# EAGLE design SparkFun_EL_Escudo_Dos (EAGLE 7.2.0)
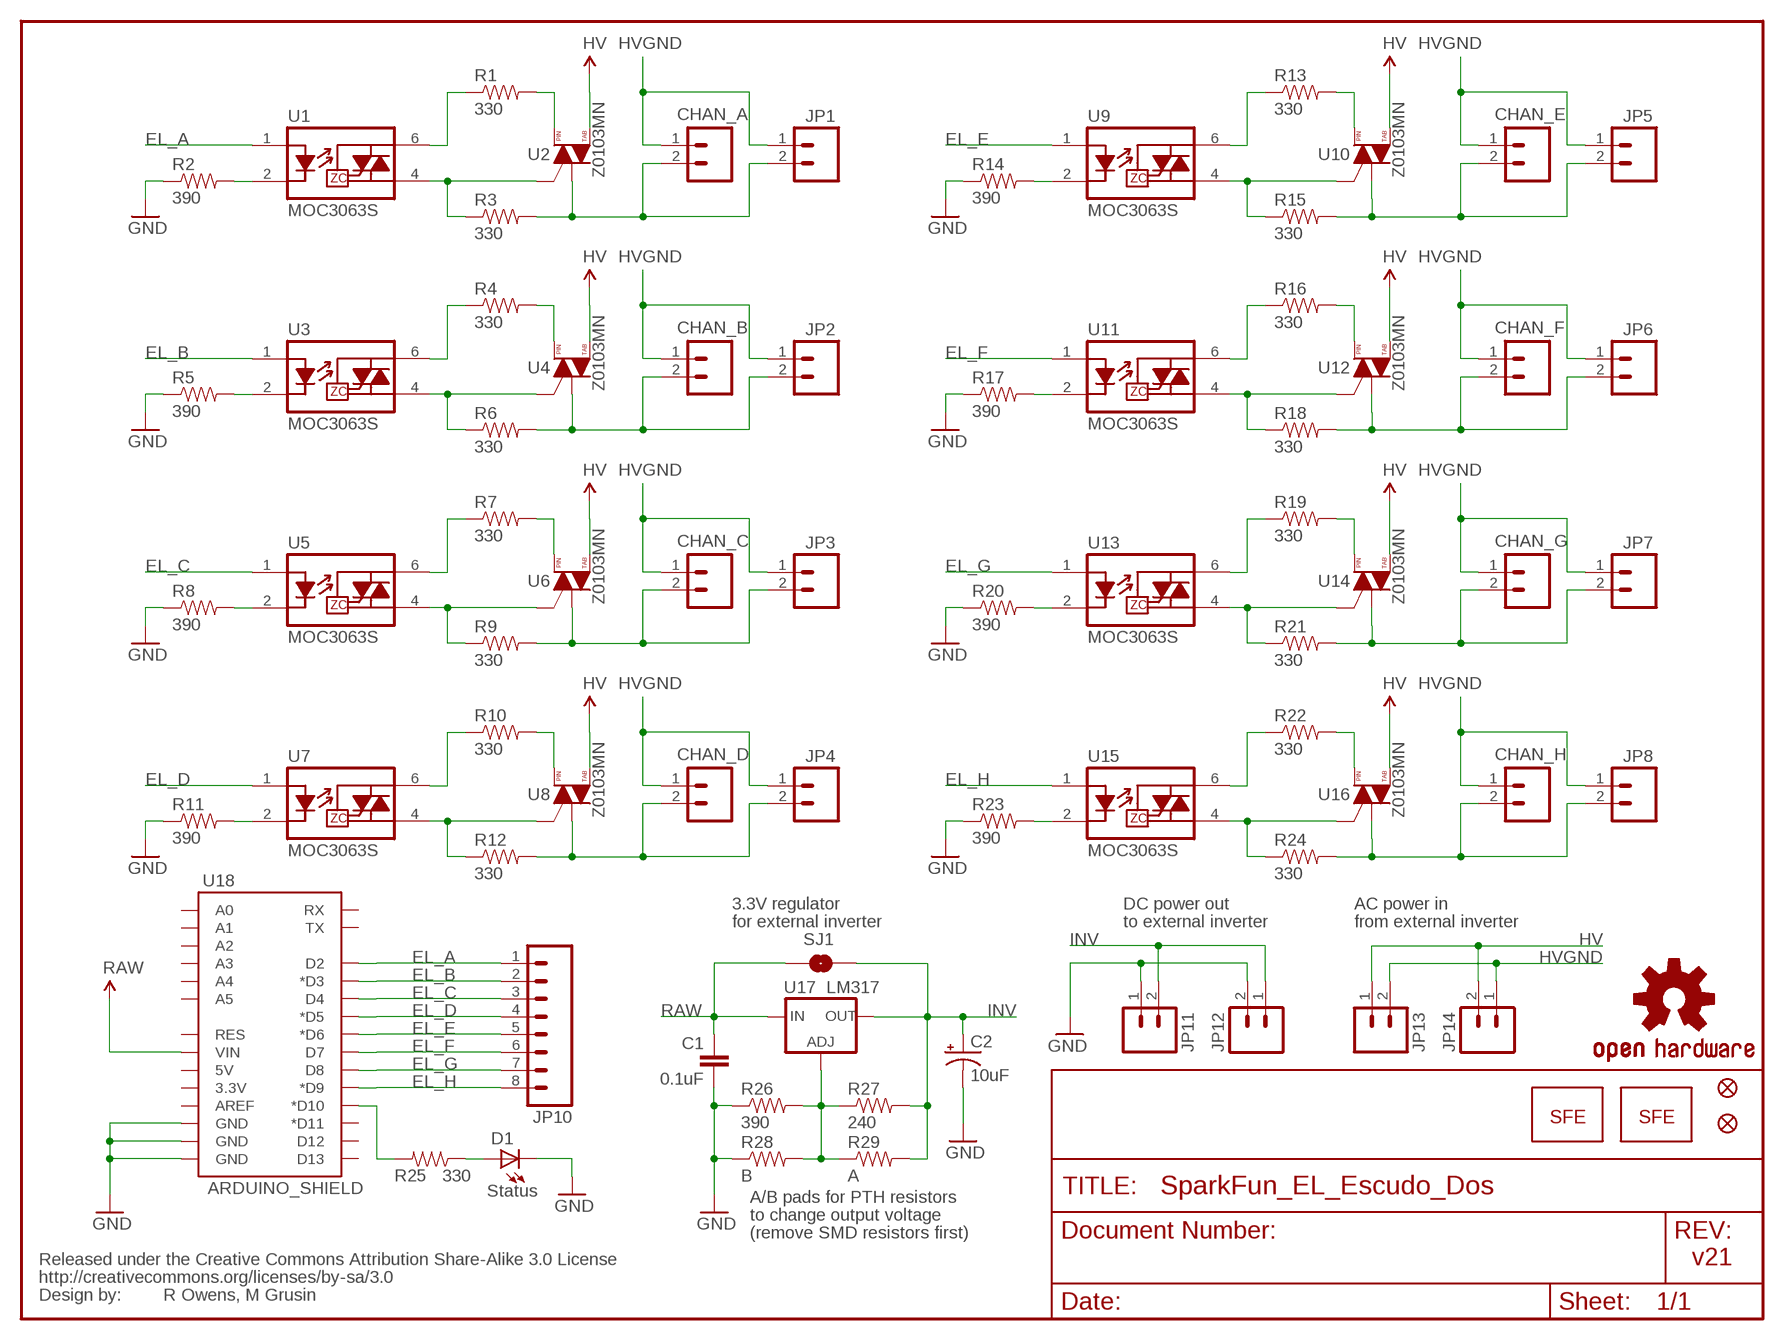
[diagram p0: schematic, sheet 1]

## Parts
C1  0.1uF  CAP0603-CAP  [0603-CAP]
C2  10uF  CAP_POL1206  [EIA3216]
CHAN_A  M02-JST-2MM-SMT  [JST-2-SMD]
CHAN_B  M02-JST-2MM-SMT  [JST-2-SMD]
CHAN_C  M02-JST-2MM-SMT  [JST-2-SMD]
CHAN_D  M02-JST-2MM-SMT  [JST-2-SMD]
CHAN_E  M02-JST-2MM-SMT  [JST-2-SMD]
CHAN_F  M02-JST-2MM-SMT  [JST-2-SMD]
CHAN_G  M02-JST-2MM-SMT  [JST-2-SMD]
CHAN_H  M02-JST-2MM-SMT  [JST-2-SMD]
D1  Status  LED0603  [LED-0603]
JP1  M02PTH  [1X02]
JP2  M02PTH  [1X02]
JP3  M02PTH  [1X02]
JP4  M02PTH  [1X02]
JP5  M02PTH  [1X02]
JP6  M02PTH  [1X02]
JP7  M02PTH  [1X02]
JP8  M02PTH  [1X02]
JP9  LOGO-SFENEW  [SFE-NEW-WEBLOGO]
JP10  M081X08  [1X08]
JP11  M02-JST-2MM-SMT  [JST-2-SMD]
JP12  M02PTH  [1X02]
JP13  M02PTH  [1X02]
JP14  M02-JST-2MM-SMT  [JST-2-SMD]
JP15  LOGO-SFENEW  [SFE-NEW-WEBLOGO]
JP16  FIDUCIALUFIDUCIAL  [MICRO-FIDUCIAL]
JP17  FIDUCIALUFIDUCIAL  [MICRO-FIDUCIAL]
R1  330  RESISTOR0603-RES  [0603-RES]
R2  390  RESISTOR0603-RES  [0603-RES]
R3  330  RESISTOR0603-RES  [0603-RES]
R4  330  RESISTOR0603-RES  [0603-RES]
R5  390  RESISTOR0603-RES  [0603-RES]
R6  330  RESISTOR0603-RES  [0603-RES]
R7  330  RESISTOR0603-RES  [0603-RES]
R8  390  RESISTOR0603-RES  [0603-RES]
R9  330  RESISTOR0603-RES  [0603-RES]
R10  330  RESISTOR0603-RES  [0603-RES]
R11  390  RESISTOR0603-RES  [0603-RES]
R12  330  RESISTOR0603-RES  [0603-RES]
R13  330  RESISTOR0603-RES  [0603-RES]
R14  390  RESISTOR0603-RES  [0603-RES]
R15  330  RESISTOR0603-RES  [0603-RES]
R16  330  RESISTOR0603-RES  [0603-RES]
R17  390  RESISTOR0603-RES  [0603-RES]
R18  330  RESISTOR0603-RES  [0603-RES]
R19  330  RESISTOR0603-RES  [0603-RES]
R20  390  RESISTOR0603-RES  [0603-RES]
R21  330  RESISTOR0603-RES  [0603-RES]
R22  330  RESISTOR0603-RES  [0603-RES]
R23  390  RESISTOR0603-RES  [0603-RES]
R24  330  RESISTOR0603-RES  [0603-RES]
R25  330  RESISTOR0603-RES  [0603-RES]
R26  390  RESISTOR0603-RES  [0603-RES]
R27  240  RESISTOR0603-RES  [0603-RES]
R28  B  RESISTORPTH-1/4W  [AXIAL-0.4]
R29  A  RESISTORPTH-1/4W  [AXIAL-0.4]
SJ1  SOLDERJUMPERNO  [SJ_2S-NO]
U1  MOC3063S  [DIP8SMD]
U2  Z0103MN  TRIACSMD  [SOT223]
U3  MOC3063S  [DIP8SMD]
U4  Z0103MN  TRIACSMD  [SOT223]
U5  MOC3063S  [DIP8SMD]
U6  Z0103MN  TRIACSMD  [SOT223]
U7  MOC3063S  [DIP8SMD]
U8  Z0103MN  TRIACSMD  [SOT223]
U9  MOC3063S  [DIP8SMD]
U10  Z0103MN  TRIACSMD  [SOT223]
U11  MOC3063S  [DIP8SMD]
U12  Z0103MN  TRIACSMD  [SOT223]
U13  MOC3063S  [DIP8SMD]
U14  Z0103MN  TRIACSMD  [SOT223]
U15  MOC3063S  [DIP8SMD]
U16  Z0103MN  TRIACSMD  [SOT223]
U17  LM317  V_REG_317DPACK  [V-REG_DPACK]
U18  ARDUINO_SHIELD  ARDUINO_SHIELDNOLABELS  [DUEMILANOVE_SHIELD_NOLABELS]
U$4  CREATIVE_COMMONS  [CREATIVE_COMMONS]
U$5  OSHW-LOGOS  [OSHW-LOGO-S]

## Nets
EL_A: JP10.1 U1.1(A) U18.D2
EL_B: JP10.2 U3.1(A) U18.D3(*D3)
EL_C: JP10.3 U5.1(A) U18.D4
EL_D: JP10.4 U7.1(A) U18.D5(*D5)
EL_E: JP10.5 U9.1(A) U18.D6(*D6)
EL_F: JP10.6 U11.1(A) U18.D7
EL_G: JP10.7 U13.1(A) U18.D8
EL_H: JP10.8 U15.1(A) U18.D9(*D9)
GND: C1.2 C2.C(-) D1.C JP11.1 JP12.2 R2.1 R5.1 R8.1 R11.1 R14.1 R17.1 R20.1 R23.1 R26.1 R28.P$1 U18.GND@0(GND) U18.GND@1(GND) U18.GND@2(GND)
HV: JP13.1 JP14.2 U2.4(T2) U4.4(T2) U6.4(T2) U8.4(T2) U10.4(T2) U12.4(T2) U14.4(T2) U16.4(T2)
HVGND: CHAN_A.1 CHAN_B.1 CHAN_C.1 CHAN_D.1 CHAN_E.1 CHAN_F.1 CHAN_G.1 CHAN_H.1 JP1.1 JP2.1 JP3.1 JP4.1 JP5.1 JP6.1 JP7.1 JP8.1 JP13.2 JP14.1
INV: C2.A(+) JP11.2 JP12.1 R27.2 R29.P$2 SJ1.2 U17.4(OUT)
N$1: R2.2 U1.2(K)
N$2: R26.2 R27.1 R28.P$2 R29.P$1 U17.1(ADJ)
N$3: R1.1 U1.6(T1)
N$4: R25.2 U18.D10(*D10)
N$5: R6.1 U3.4(T2) U4.3(G)
N$6: R5.2 U3.2(K)
N$7: R4.1 U3.6(T1)
N$8: CHAN_B.2 JP2.2 R6.2 U4.1(T1)
N$9: R1.2 U2.2(T2)
N$10: R9.1 U5.4(T2) U6.3(G)
N$11: R8.2 U5.2(K)
N$12: R7.1 U5.6(T1)
N$13: CHAN_C.2 JP3.2 R9.2 U6.1(T1)
N$14: D1.A R25.1
N$15: R4.2 U4.2(T2)
N$16: R12.1 U7.4(T2) U8.3(G)
N$17: R11.2 U7.2(K)
N$18: R10.1 U7.6(T1)
N$19: CHAN_D.2 JP4.2 R12.2 U8.1(T1)
N$20: R7.2 U6.2(T2)
N$21: CHAN_A.2 JP1.2 R3.2 U2.1(T1)
N$22: R15.1 U9.4(T2) U10.3(G)
N$23: R14.2 U9.2(K)
N$24: R13.1 U9.6(T1)
N$25: CHAN_E.2 JP5.2 R15.2 U10.1(T1)
N$26: R10.2 U8.2(T2)
N$27: R18.1 U11.4(T2) U12.3(G)
N$28: R17.2 U11.2(K)
N$29: R16.1 U11.6(T1)
N$30: CHAN_F.2 JP6.2 R18.2 U12.1(T1)
N$31: R13.2 U10.2(T2)
N$32: R21.1 U13.4(T2) U14.3(G)
N$33: R20.2 U13.2(K)
N$34: R19.1 U13.6(T1)
N$35: CHAN_G.2 JP7.2 R21.2 U14.1(T1)
N$36: R16.2 U12.2(T2)
N$37: R24.1 U15.4(T2) U16.3(G)
N$38: R23.2 U15.2(K)
N$39: R22.1 U15.6(T1)
N$40: CHAN_H.2 JP8.2 R24.2 U16.1(T1)
N$41: R19.2 U14.2(T2)
N$42: R22.2 U16.2(T2)
N$117: R3.1 U1.4(T2) U2.3(G)
RAW: C1.1 SJ1.1 U17.3(IN) U18.VIN
Unconnected: U18.3.3V U18.5V U18.A0 U18.A1 U18.A2 U18.A3 U18.A4 U18.A5 U18.AREF U18.D11(*D11) U18.D12 U18.D13 U18.RES U18.RX U18.TX

## Notes on the sheet
- 3.3V regulator | DC power out | AC power in
- for external inverter | to external inverter | from external inverter
- A/B pads for PTH resistors
- to change output voltage
- (remove SMD resistors first)
- v21
- R Owens, M Grusin

## Library data of the parts
C1 = SparkFun:CAP: Capacitor Standard 0603 ceramic capacitor, and 0.1" leaded capacitor.
C2 = SparkFun:CAP_POL: Capacitor Polarized These are standard SMD and PTH capacitors. Normally 10uF, 47uF, and 100uF in electrolytic and tantalum varieties. Always verify the external diameter of the through hole cap, it varies with capacity, voltage, and manufacturer. The EIA devices should be standard.
CHAN_A CHAN_B CHAN_C CHAN_D CHAN_E CHAN_F CHAN_G CHAN_H JP1-JP8 JP11-JP14 = SparkFun:M02: Header 2 Standard 2-pin 0.1" header. Use with straight break away headers (SKU : PRT-00116), right angle break away headers (PRT-00553), swiss pins (PRT-00743), machine pins (PRT-00117), and female headers (PRT-00115). Molex polarized connector foot print use with SKU : PRT-08233 with associated crimp pins and housings.
D1 = SparkFun:LED: LEDs Standard schematic elements and footprints for 5mm, 3mm, 1206, and 0603 sized LEDs. 5mm - Spark Fun Electronics SKU : COM-00529 (and others)
JP9 JP15 = SparkFun:LOGO-SFE: Spark Fun Electronics PCB Logo This is the standard Spark Fun Electronics PCB logo.
JP10 = SparkFun:M08: Header 8 Standard 8-pin 0.1" header. Use with straight break away headers (SKU : PRT-00116), right angle break away headers (PRT-00553), swiss pins (PRT-00743), machine pins (PRT-00117), and female headers (PRT-00115).
JP16 JP17 = SparkFun:FIDUCIAL: Fiducial Alignment Points Various fiducial points for machine vision alignment.
R1-R29 = SparkFun:RESISTOR: Resistor Basic schematic elements and footprints for 0603, 1206, and PTH resistors.
SJ1 = SparkFun:SOLDERJUMPER: Solder Jumper Standard SMD solder jumper. Used to automate production. Two varients : Normally Open and Normally Closed are the same, but have different paste layers. NC will have a large amount of paste and should jumper during reflow.
U1 U3 U5 U7 U9 U11 U13 U15 = mike-temp:MOC3063*: Optotriac in DIP and SMD LED: Vf: 1.2V If: 5 mA TRIAC Vdrm: 600V Itsm: 1A Viso: 5000V DV/dt: 1500V/us DIP: MOC3063 SMD: MOC3063S
U2 U4 U6 U8 U10 U12 U14 U16 = mike-temp:TRIAC
U17 = SparkFun:V_REG_317: Voltage Regulator Standard LM317 adjustable voltage regulator. AOI (Adjust Output Input). Google 'LM317 Calculator' for easy to use app to get the two resistor values needed. 240/720 for 5V output. 240/390 for 3.3V output. Spark Fun Electronics SKU : COM-00527
U18 = SparkFun:ARDUINO_SHIELD
U$4 = SparkFun:CREATIVE_COMMONS
U$5 = SparkFun:OSHW-LOGO: Open Source Hardware Logo This logo indicates the piece of hardware it is found on incorporates a OSHW license and/or adheres to the definition of open source hardware found here: http://freedomdefined.org/OSHW

## Net classes
0 Default: width 0.203 mm
1 VCC: width 0.305 mm
2 GND: width 0.813 mm
3 HV: width 0.381 mm

## Board
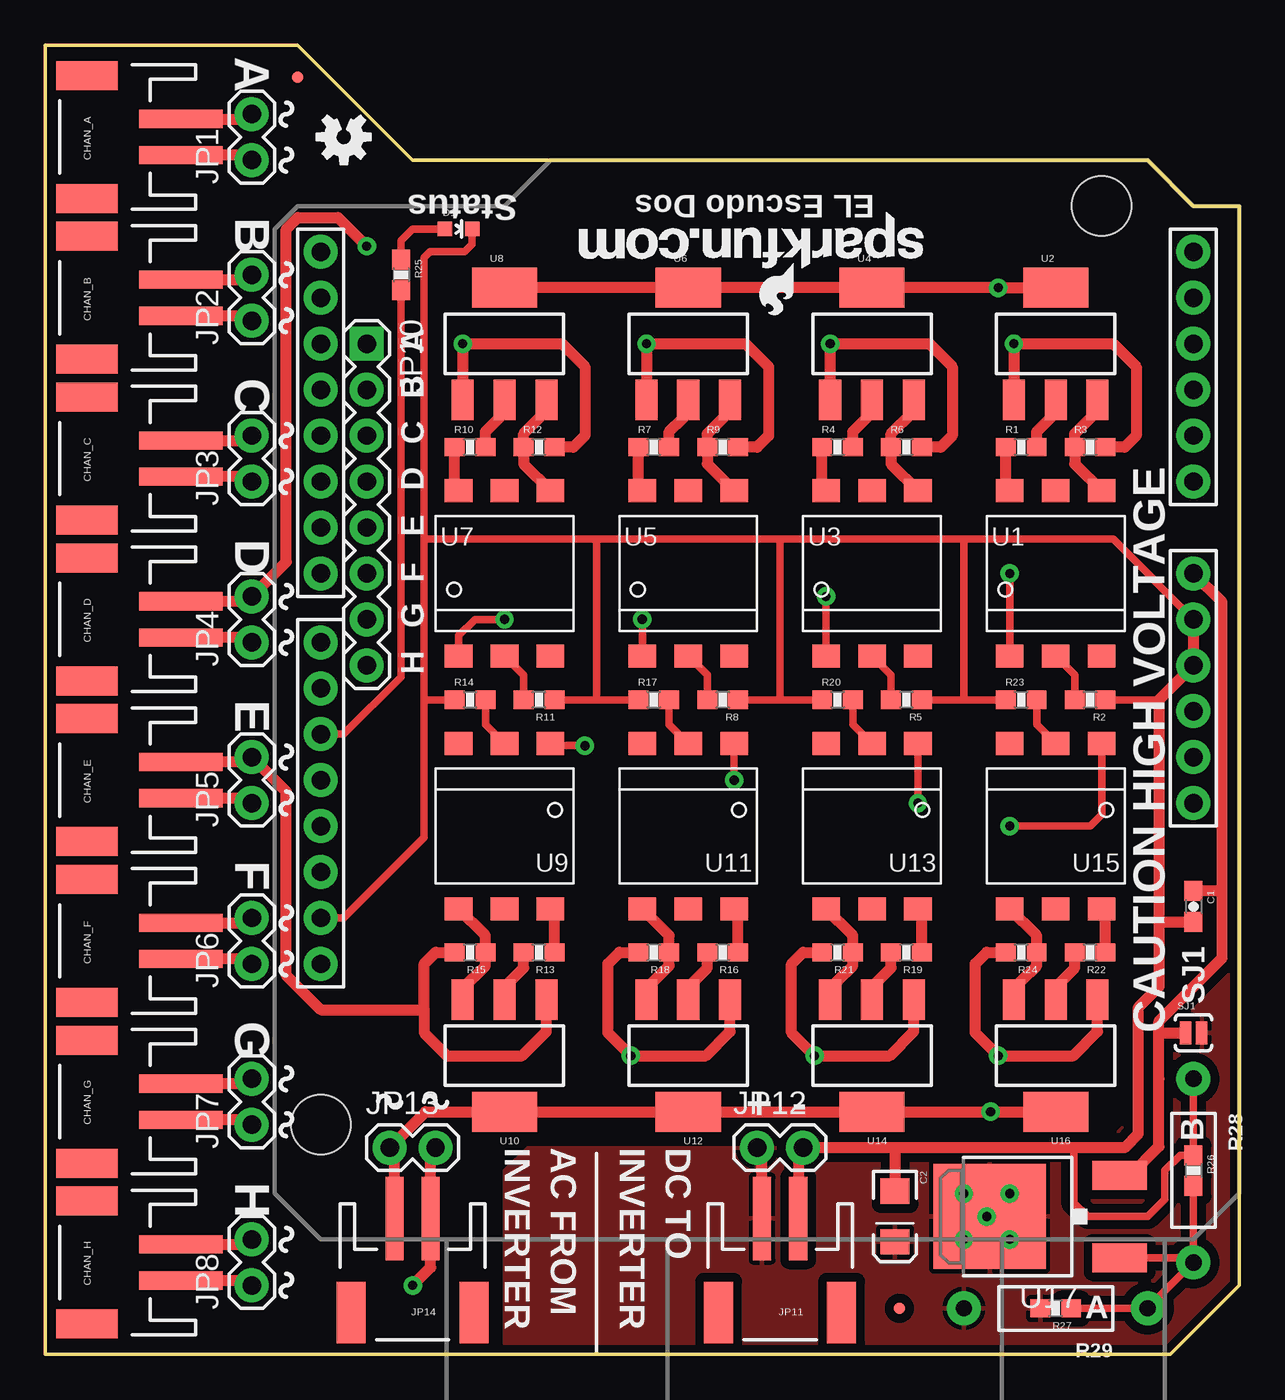
[diagram p1: board, top side]
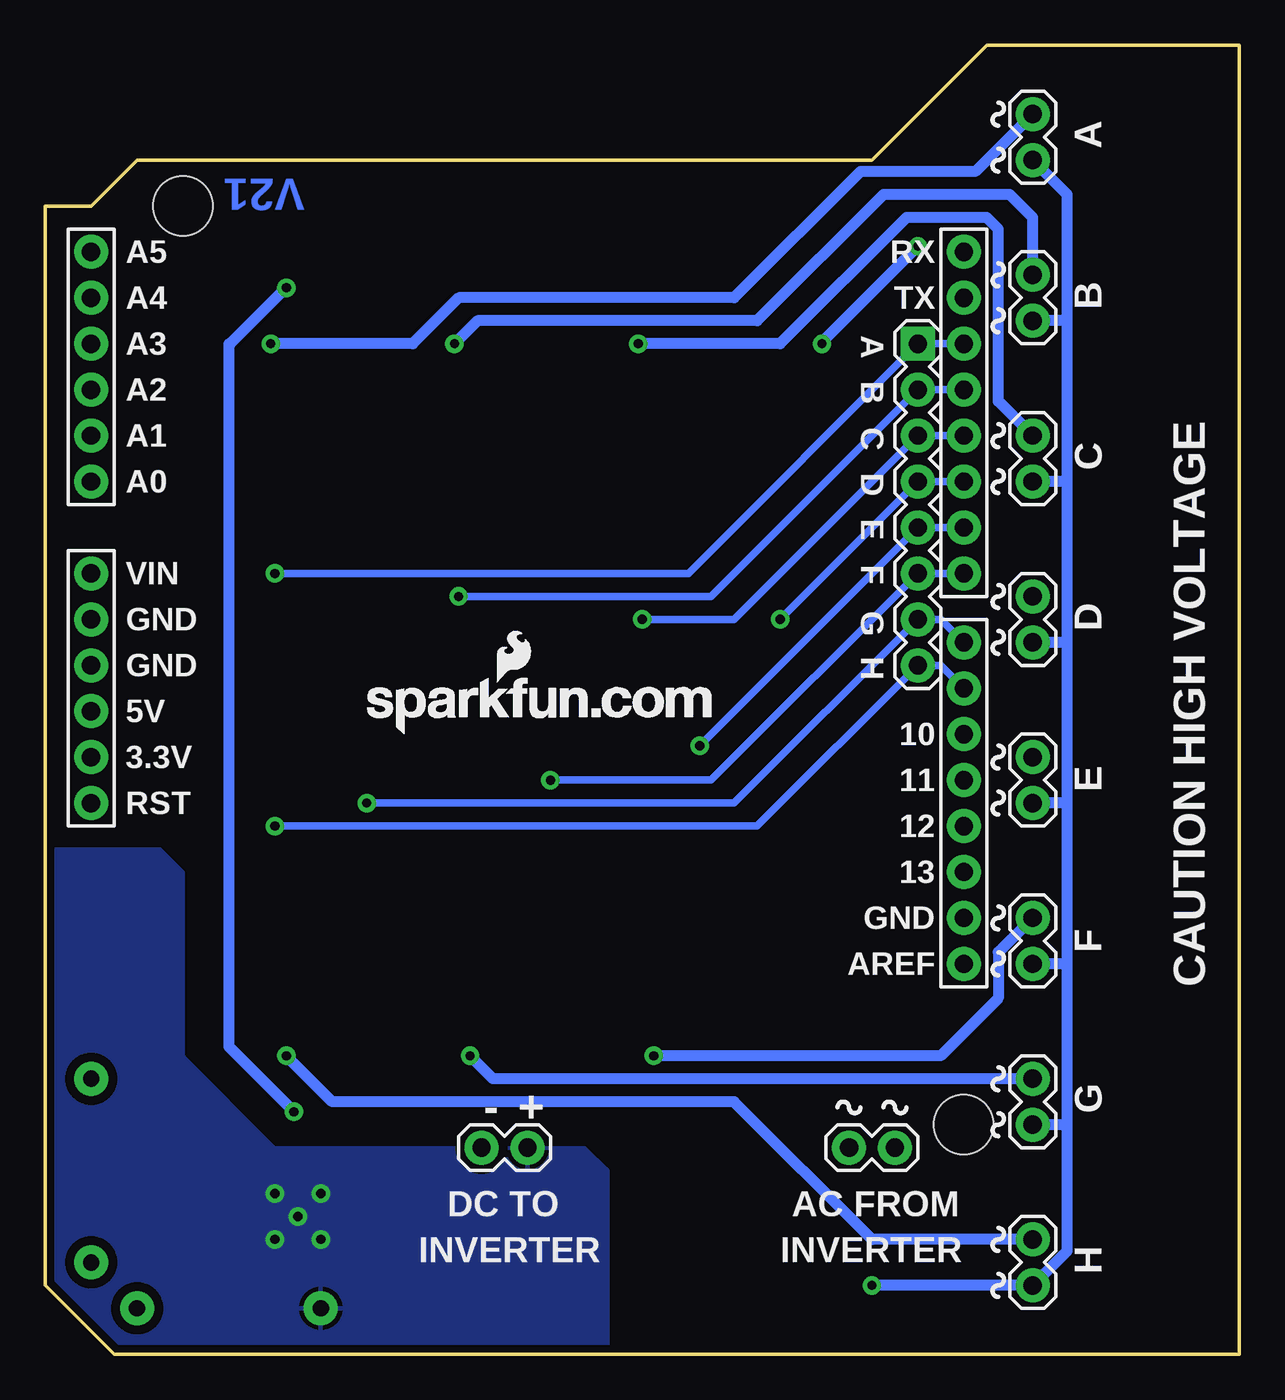
[diagram p2: board, bottom side, seen from below]

Size 66.04 x 72.39 mm. Coordinates in mm from the lower left corner, seen from the top.
Outline: 20.32,66.04 13.97,72.39 0,72.39 0,0 62.23,0 66.04,3.81 66.04,63.5 63.5,63.5 60.96,66.04 20.32,66.04
Copper layers (1*16): Top 0.035mm / dielectric 1.5mm / Bottom 0.035mm
Design rules "default": minimum track width 8mil, minimum drill 20mil, track to track 0.5mm, track to pad 0.5mm, pad to pad 0.5mm, via to via 0.5mm, smd to smd 8mil, copper to edge 10mil, drill to drill 8mil, minimum pad ring 12mil, minimum via ring 10mil, stop-mask expansion 4mil, vias tented up to drill 25mil, thermal gap 10mil

### Footprints (pad centres in the part's own frame; a part is rotated, then mirrored left to right if it is on the bottom)
0603-CAP = smd 1.1 x 1: 1 -0.85,0; 2 0.85,0
EIA3216 = smd 1.4 x 1.6: A 1.4,0; C -1.4,0
JST-2-SMD = smd 1 x 4.6: 1 -1,-3.7; 2 1,-3.7 | smd 1.6 x 3.4: NC1 -3.4,1.5; NC2 3.4,1.5
LED-0603 = smd 0.8 x 0.8: A 0,-0.75; C 0,0.75
1X02 = drill 1.016 pad 1.88: 1 0,0; 2 2.54,0
1X08 = drill 1.016 pad 1.88 square: 1 0,0 | drill 1.016 pad 1.88: 2 2.54,0; 3 5.08,0; 4 7.62,0; 5 10.16,0; 6 12.7,0; 7 15.24,0; 8 17.78,0
MICRO-FIDUCIAL = smd 0.635 x 0.635: 1 0,0
0603-RES = smd 1.1 x 1: 1 -0.85,0; 2 0.85,0
AXIAL-0.4 = drill 0.9 pad 1.88: P$1 -5.08,0; P$2 5.08,0
SJ_2S-NO = smd 0.635 x 1.27: 1 -0.45,0; 2 0.45,0
DIP8SMD = smd 1.524 x 1.27: 1 -2.54,-4.572; 2 0,-4.572; 3 2.54,-4.572; 4 2.54,4.572; 5 0,4.572; 6 -2.54,4.572
SOT223 = smd 1.219 x 2.235: 1 -2.311,-3.099; 2 0,-3.099; 3 2.311,-3.099 | smd 3.6 x 2.2: 4 0,3.099
V-REG_DPACK = smd 1.6 x 3: 1 -2.28,-4.8; 3 2.28,-4.8 | smd 5.8 x 6.2: 4 0,2.38
DUEMILANOVE_SHIELD_NOLABELS = drill 1.016 pad 1.88: 3.3V 50.8,26.67; 5V 50.8,29.21; A0 50.8,41.91; A1 50.8,44.45; A2 50.8,46.99; A3 50.8,49.53; A4 50.8,52.07; A5 50.8,54.61; AREF 2.54,15.24; D2 2.54,49.53; D3 2.54,46.99; D4 2.54,44.45; D5 2.54,41.91; D6 2.54,39.37; D7 2.54,36.83; D8 2.54,33.02; D9 2.54,30.48; D10 2.54,27.94; D11 2.54,25.4; D12 2.54,22.86; D13 2.54,20.32; GND@0 50.8,31.75; GND@1 50.8,34.29; GND@2 2.54,17.78; RES 50.8,24.13; RX 2.54,54.61; TX 2.54,52.07; VIN 50.8,36.83 | hole 3.302: 45.72,57.15; 2.54,6.35

### Placement (x,y rotation side)
C1  63.5,24.77 270 top
C2  46.99,7.62 270 top
CHAN_A  3.81,67.31 90 top
CHAN_B  3.81,58.42 90 top
CHAN_C  3.81,49.53 90 top
CHAN_D  3.81,40.64 90 top
CHAN_E  3.81,31.75 90 top
CHAN_F  3.81,22.86 90 top
CHAN_G  3.81,13.97 90 top
CHAN_H  3.81,5.08 90 top
D1  22.86,62.23 270 top
JP1  11.43,66.04 90 top
JP2  11.43,57.15 90 top
JP3  11.43,48.26 90 top
JP4  11.43,39.37 90 top
JP5  11.43,30.48 90 top
JP6  11.43,21.59 90 top
JP7  11.43,12.7 90 top
JP8  11.43,3.81 90 top
JP9  48.58,63.18 180 top
JP10  17.78,55.88 270 top
JP11  40.64,3.81 180 top
JP12  39.37,11.43 0 top
JP13  19.05,11.43 0 top
JP14  20.32,3.81 180 top
JP15  48.26,34.29 0 bottom
JP16  13.97,70.61 0 top
JP17  47.24,2.54 0 top
R1  53.98,50.16 0 top
R2  57.78,36.2 180 top
R3  57.78,50.16 0 top
R4  43.81,50.16 0 top
R5  47.62,36.2 180 top
R6  47.62,50.16 0 top
R7  33.66,50.16 0 top
R8  37.47,36.2 180 top
R9  37.47,50.16 0 top
R10  23.5,50.16 0 top
R11  27.3,36.2 180 top
R12  27.3,50.16 0 top
R13  27.3,22.23 180 top
R14  23.5,36.2 0 top
R15  23.5,22.23 180 top
R16  37.47,22.23 180 top
R17  33.66,36.2 0 top
R18  33.66,22.23 180 top
R19  47.62,22.23 180 top
R20  43.81,36.2 0 top
R21  43.81,22.23 180 top
R22  57.78,22.23 180 top
R23  53.98,36.2 0 top
R24  53.98,22.23 180 top
R25  19.68,59.69 270 top
R26  63.5,10.16 270 top
R27  55.88,2.54 180 top
R28  63.5,10.16 270 top
R29  55.88,2.54 180 top
SJ1  63.5,17.78 0 top
U1  55.88,43.18 0 top
U2  55.88,55.88 0 top
U3  45.72,43.18 0 top
U4  45.72,55.88 0 top
U5  35.56,43.18 0 top
U6  35.56,55.88 0 top
U7  25.4,43.18 0 top
U8  25.4,55.88 0 top
U9  25.4,29.21 180 top
U10  25.4,16.51 180 top
U11  35.56,29.21 180 top
U12  35.56,16.51 180 top
U13  45.72,29.21 180 top
U14  45.72,16.51 180 top
U15  55.88,29.21 180 top
U16  55.88,16.51 180 top
U17  54.61,7.62 90 top
U18  12.7,6.35 0 top
U$4  0,-11.43 0 top  (outside the outline)
U$5  16.51,67.31 180 top

### Tracks (layer width: path | path; a pad name or v marks a point on that pad's centre or on a via)
EL_A  (via drill 0.51)
  Top 0.406: v53.34,43.18 U1.1
  Bottom 0.406: v53.34,43.18 30.48,43.18 JP10.1 U18.D2
EL_B  (via drill 0.51)
  Top 0.406: v43.18,41.91 U3.1
  Bottom 0.406: v43.18,41.91 29.21,41.91 JP10.2 U18.D3
EL_C  (via drill 0.51)
  Top 0.406: v33.02,40.64 U5.1
  Bottom 0.406: v33.02,40.64 27.94,40.64 JP10.3 U18.D4
EL_D  (via drill 0.51)
  Top 0.406: U7.1 22.86,39.74 23.76,40.64 v25.4,40.64
  Bottom 0.406: v25.4,40.64 JP10.4 U18.D5
EL_E  (via drill 0.51)
  Top 0.406: v29.84,33.66 27.94,33.66 U9.1
  Bottom 0.406: v29.84,33.66 JP10.5 U18.D6
EL_F  (via drill 0.51)
  Top 0.406: v38.1,31.75 U11.1
  Bottom 0.406: v38.1,31.75 29.21,31.75 JP10.6 U18.D7
EL_G  (via drill 0.51)
  Top 0.406: v48.26,30.48 U13.1
  Bottom 0.406: v48.26,30.48 27.94,30.48 JP10.7 16.51,40.64 U18.D8
EL_H  (via drill 0.51)
  Top 0.406: v53.34,29.21 57.78,29.21 58.42,29.84 U15.1
  Bottom 0.406: v53.34,29.21 26.67,29.21 JP10.8 16.51,38.1 U18.D9
GND
  Top 0.406: 20.95,45.09 30.48,45.09 | 30.48,45.09 40.64,45.09 | 40.64,45.09 50.8,45.09 | 50.8,36.2 R23.1 | 50.8,45.09 50.8,36.2 | 40.64,36.2 R20.1 | 40.64,45.09 40.64,36.2 | 30.48,36.2 R17.1 | 30.48,45.09 30.48,36.2 | 30.48,36.2 R11.1 | 40.64,36.2 R8.1 | 50.8,36.2 R5.1 | 20.95,36.2 R14.1 | 20.95,36.2 20.95,45.09 | 50.8,45.09 59.05,45.09 U18.GND@1 | 56.9,11.43 56.9,8.38 57.66,7.62 60.96,7.62 61.91,8.57 61.91,10.16 62.76,11.01 R26.1 R28.P$1 | 61.59,36.2 R2.1 | D1.C 23.61,61.39 23.18,60.96 21.27,60.96 20.95,60.64 20.95,45.09 | 20.95,36.2 20.95,28.57 16.51,24.13 U18.GND@2
  Top 0.61: JP11.1 41.64,11.16 JP12.2 46.99,11.43 | 46.99,11.43 C2.C | 46.99,11.43 56.9,11.43 59.69,11.43 60.43,12.17 60.43,19.15 61.59,20.32 61.59,23.91 | U18.GND@1 U18.GND@0 61.59,36.2 61.59,23.91 | 61.59,23.91 C1.2
HV  (via drill 0.51)
  Top 0.61: JP14.2 19.32,11.16 JP13.1 21.03,13.41 U10.4 U12.4 U14.4 v52.29,13.41 U16.4 | U8.4 U6.4 U4.4 v52.7,58.98 U2.4
  Bottom 0.61: v52.29,13.41 55.88,17 55.88,55.88 55.8,55.88 v52.7,58.98
HVGND  (via drill 0.51)
  Top 0.61: JP1.1 11.16,66.31 CHAN_A.1 | JP2.1 11.16,57.42 CHAN_B.1 | JP3.1 11.16,48.53 CHAN_C.1 | JP4.1 11.16,39.64 CHAN_D.1 | JP5.1 11.16,30.75 CHAN_E.1 | JP6.1 11.16,21.86 CHAN_F.1 | JP7.1 11.16,12.97 CHAN_G.1 | JP8.1 11.16,4.08 CHAN_H.1 | v20.32,3.81 21.32,4.81 JP14.1 21.32,11.16 JP13.2
  Bottom 0.61: JP1.1 9.53,64.14 9.53,57.15 | 9.53,57.15 JP2.1 | 9.53,48.26 9.53,57.15 | 9.53,48.26 JP3.1 | 9.53,39.37 9.53,48.26 | 9.53,39.37 JP4.1 | 9.53,30.48 9.53,39.37 | 9.53,30.48 JP5.1 | 9.53,21.59 9.53,30.48 | 9.53,21.59 JP6.1 | 9.53,12.7 9.53,21.59 | 9.53,12.7 JP7.1 | 9.53,12.7 9.53,5.71 JP8.1 v20.32,3.81
INV  (via drill 0.51)
  Top 0.61: JP11.2 39.64,11.16 JP12.1
  other vias: 50.8,6.35 50.8,8.89 53.34,8.89 53.34,6.35 52.07,7.62
  pour Bottom (isolate 0.406): 34.92,0 34.92,10.16 36.2,11.43 53.34,11.43 58.42,16.51 58.42,26.67 59.69,27.94 66.04,27.94 66.04,3.81 62.23,0
  pour Top (isolate 0.406): 62.23,0 25.4,0 25.4,10.16 26.67,11.43 58.42,11.43 60.96,13.97 60.96,17.78 66.04,22.86 66.04,3.81
N$1
  Top 0.406: R2.2 56.94,37.55 U1.2
N$2
  Top 0.406: R27.1 R29.P$1 62.23,3.81 R28.P$2 R26.2 | 63.24,5.34 U17.1
  Top 0.61: R28.P$2 63.24,5.34
N$3
  Top 0.61: R1.1 53.12,47.97 U1.6
N$4
  Top 0.406: R25.2 19.68,37.47 16.51,34.29 U18.D10
N$5
  Top 0.61: U3.4 46.77,49.24 R6.1 46.77,50.9 47.94,52.07 47.94,52.69 U4.3
N$6
  Top 0.406: R5.2 46.77,37.55 U3.2
N$7
  Top 0.61: R4.1 42.97,47.97 U3.6
N$8  (via drill 0.51)
  Top 0.61: JP2.2 11.16,59.42 CHAN_B.2 | R6.2 49.53,50.16 50.16,50.8 50.16,54.61 48.9,55.88 v43.41,55.88 U4.1
  Bottom 0.61: JP2.2 11.43,62.87 12.7,64.14 19.68,64.14 26.67,57.15 42.14,57.15 v43.41,55.88
N$9
  Top 0.61: R1.2 54.83,51.02 55.88,52.07 U2.2
N$10
  Top 0.61: U5.4 36.62,49.24 R9.1 36.62,50.9 37.78,52.07 37.78,52.69 U6.3
N$11
  Top 0.406: R8.2 36.62,37.55 U5.2
N$12
  Top 0.61: R7.1 32.8,47.97 U5.6
N$13  (via drill 0.51)
  Top 0.61: JP3.2 11.16,50.53 CHAN_C.2 | R9.2 39.37,50.16 40.01,50.8 40.01,54.61 38.73,55.88 v33.25,55.88 U6.1
  Bottom 0.61: JP3.2 13.34,52.7 13.34,62.23 13.97,62.87 18.41,62.87 25.4,55.88 v33.25,55.88
N$14
  Top 0.406: R25.1 19.68,61.59 20.32,62.23 D1.A
N$15
  Top 0.61: R4.2 44.66,51.02 45.72,52.07 U4.2
N$16
  Top 0.61: U7.4 26.45,49.24 R12.1 26.45,50.9 27.62,52.07 27.71,52.16 U8.3
N$17
  Top 0.406: R11.2 26.45,37.55 U7.2
N$18
  Top 0.61: R10.1 22.64,47.97 U7.6
N$19  (via drill 0.51)
  Top 0.61: CHAN_D.2 11.16,41.64 JP4.2 13.34,43.81 13.34,62.23 13.97,62.87 16.19,62.87 v17.78,61.28 | R12.2 29.21,50.16 29.84,50.8 29.84,54.61 28.57,55.88 v23.09,55.88 U8.1
  Bottom 0.61: v23.09,55.88 23.09,55.97 v17.78,61.28
N$20
  Top 0.61: R7.2 34.51,51.02 35.24,51.75 35.56,52.07 U6.2
N$21  (via drill 0.51)
  Top 0.61: JP1.2 11.16,68.31 CHAN_A.2 | R3.2 59.69,50.16 60.33,50.8 60.33,54.61 59.05,55.88 v53.57,55.88 U2.1
  Bottom 0.61: JP1.2 14.61,65.41 20.95,65.41 27.94,58.42 43.18,58.42 45.72,55.88 v53.57,55.88
N$22
  Top 0.61: U9.4 24.34,23.15 R15.1 24.34,21.49 23.09,20.23 U10.3
N$23
  Top 0.406: R14.2 24.34,34.84 U9.2
N$24
  Top 0.61: R13.1 28.16,24.42 U9.6
N$25
  Top 0.61: CHAN_E.2 11.16,32.75 JP5.2 13.34,31.11 13.34,20.95 15.24,19.05 20.95,19.05 | 20.95,19.05 20.95,17.78 22.23,16.51 26.38,16.51 27.71,17.84 U10.1 | 20.95,19.05 20.95,21.59 21.59,22.23 R15.2
N$26
  Top 0.61: R10.2 24.34,51.02 25.4,52.07 U8.2
N$27
  Top 0.61: U11.4 34.51,23.15 R18.1 34.51,21.49 33.66,20.64 33.25,20.23 U12.3
N$28
  Top 0.406: R17.2 34.51,34.84 U11.2
N$29
  Top 0.61: R16.1 38.31,24.42 U11.6
N$30  (via drill 0.51)
  Top 0.61: JP6.2 11.16,23.86 CHAN_F.2 | R18.2 31.75,22.23 31.11,21.59 31.11,17.78 v32.38,16.51 36.54,16.51 37.87,17.84 U12.1
  Bottom 0.61: JP6.2 13.34,22.23 13.34,19.68 16.51,16.51 v32.38,16.51
N$31
  Top 0.61: R13.2 26.45,21.38 25.4,20.32 U10.2
N$32
  Top 0.61: U13.4 44.66,23.15 R21.1 44.66,21.49 43.81,20.64 43.41,20.23 U14.3
N$33
  Top 0.406: R20.2 44.66,34.84 U13.2
N$34
  Top 0.61: R19.1 48.48,24.42 U13.6
N$35  (via drill 0.51)
  Top 0.61: JP7.2 11.16,14.97 CHAN_G.2 | R21.2 41.91,22.23 41.27,21.59 41.27,17.78 v42.55,16.51 46.7,16.51 48.03,17.84 U14.1
  Bottom 0.61: JP7.2 41.27,15.24 v42.55,16.51
N$36
  Top 0.61: R16.2 36.62,21.38 35.56,20.32 U12.2
N$37
  Top 0.61: U15.4 54.83,23.15 R24.1 54.83,21.49 53.98,20.64 53.57,20.23 U16.3
N$38
  Top 0.406: R23.2 54.83,34.84 U15.2
N$39
  Top 0.61: R22.1 58.63,24.42 U15.6
N$40  (via drill 0.51)
  Top 0.61: JP8.2 11.16,6.08 CHAN_H.2 | R24.2 52.07,22.23 51.44,21.59 51.44,17.78 v52.7,16.51 56.86,16.51 58.19,17.84 U16.1
  Bottom 0.61: JP8.2 20.32,6.35 27.94,13.97 50.16,13.97 v52.7,16.51
N$41
  Top 0.61: R19.2 46.77,21.38 45.72,20.32 U14.2
N$42
  Top 0.61: R22.2 56.94,21.38 55.88,20.32 U16.2
N$117
  Top 0.61: U2.3 58.19,52.16 56.94,50.9 R3.1 56.94,49.24 U1.4
RAW
  Top 0.61: U17.3 60.01,9.9 | 60.01,9.9 60.54,9.9 | U18.VIN 65.09,41.59 65.09,25.61 | 61.59,17.78 61.59,15.24 61.59,11.49 60.01,9.9 | 61.59,17.78 61.59,18.41 65.09,21.91 65.09,25.61 | 65.09,25.61 C1.1 | 61.59,17.78 SJ1.1

### Text on the board
Bottom: V21
tPlace: A | Status | EL Escudo Dos | B | A | C | B | C | D | D | E | F | G | H | E | F | SJ1 | G | CAUTION HIGH VOLTAGE | + | - | INVERTER | AC FROM | INVERTER | DC TO | H
bPlace: A | RX | A5 | TX | B | A4 | A | A3 | B | A2 | C | A1 | C | D | A0 | E | F | VIN | G | D | GND | H | GND | 10 | 5V | 11 | 3.3V | E | 12 | RST | 13 | GND | F | AREF | CAUTION HIGH VOLTAGE | + | - | G | AC FROM | DC TO | INVERTER | INVERTER | H
tValues: R Owens, M Grusin